# EAGLE design robot (EAGLE 5.12)
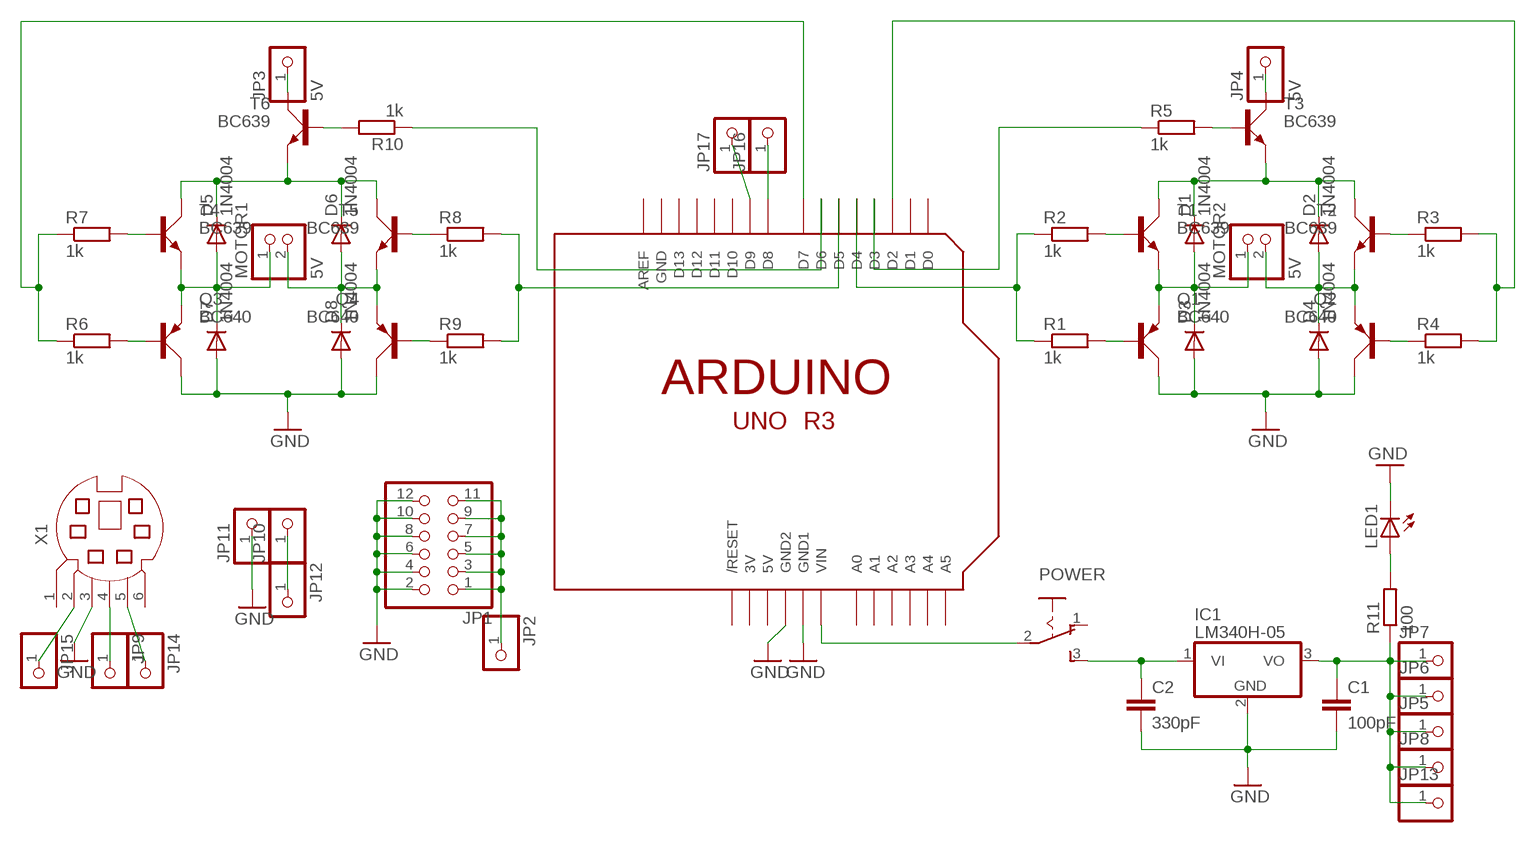
[diagram p0: schematic, sheet 1]

## Parts
C1  100pF  C-EU025-024X044  [C025-024X044]
C2  330pF  C-EU025-024X044  [C025-024X044]
D1  1N4004  [DO41-10]
D2  1N4004  [DO41-10]
D3  1N4004  [DO41-10]
D4  1N4004  [DO41-10]
D5  1N4004  [DO41-10]
D6  1N4004  [DO41-10]
D7  1N4004  [DO41-10]
D8  1N4004  [DO41-10]
IC1  LM340H-05  [TO220H]
JP1  PINHD-2X6  [2X06]
JP2  PINHD-1X1  [1X01]
JP3  5V  PINHD-1X1  [1X01]
JP4  5V  PINHD-1X1  [1X01]
JP5  PINHD-1X1  [1X01]
JP6  PINHD-1X1  [1X01]
JP7  PINHD-1X1  [1X01]
JP8  PINHD-1X1  [1X01]
JP9  PINHD-1X1  [1X01]
JP10  PINHD-1X1  [1X01]
JP11  PINHD-1X1  [1X01]
JP12  PINHD-1X1  [1X01]
JP13  PINHD-1X1  [1X01]
JP14  PINHD-1X1  [1X01]
JP15  PINHD-1X1  [1X01]
JP16  PINHD-1X1  [1X01]
JP17  PINHD-1X1  [1X01]
LED1  LED3MM  [LED3MM]
MOTOR1  5V  PINHD-1X2  [1X02]
MOTOR2  5V  PINHD-1X2  [1X02]
POWER  255SB  [255SB]
Q1  BC640  [SOT54D]
Q2  BC640  [SOT54D]
Q3  BC640  [SOT54D]
Q4  BC640  [SOT54D]
R1  1k  R-EU_0207/7  [0207/7]
R2  1k  R-EU_0207/7  [0207/7]
R3  1k  R-EU_0207/7  [0207/7]
R4  1k  R-EU_0207/7  [0207/7]
R5  1k  R-EU_0207/7  [0207/7]
R6  1k  R-EU_0207/7  [0207/7]
R7  1k  R-EU_0207/7  [0207/7]
R8  1k  R-EU_0207/7  [0207/7]
R9  1k  R-EU_0207/7  [0207/7]
R10  1k  R-EU_0207/7  [0207/7]
R11  100  R-EU_0207/7  [0207/7]
T1  BC639  [SOT54D]
T2  BC639  [SOT54D]
T3  BC639  [SOT54D]
T4  BC639  [SOT54D]
T5  BC639  [SOT54D]
T6  BC639  [SOT54D]
U$1  ARDUINO-NOHOLE  [ARDUINO-NOHOLE]
X1  MD06SS  [MDIN06SS]

## Nets
GND: C1.2 C2.2 D3.A D4.A D7.A D8.A IC1.2(GND) JP1.2 JP1.4 JP1.6 JP1.8 JP1.10 JP1.12 JP11.1 LED1.K(C) Q1.C Q2.C Q3.C Q4.C U$1.GND1 U$1.GND2 X1.3
N$1: D1.C D2.C T1.C T2.C T3.E
N$2: R7.2 T4.B
N$3: D1.A D3.C MOTOR2.1 Q1.E T1.E
N$4: R3.2 R4.2 U$1.D2
N$5: D2.A D4.C MOTOR2.2 Q2.E T2.E
N$6: R1.1 R2.1 U$1.D4
N$7: R5.1 U$1.D3
N$8: R10.1 U$1.D6
N$9: Q3.B R6.2
N$10: JP14.1 X1.5
N$12: JP3.1 T6.C
N$13: POWER.2(P) U$1.VIN
N$14: D6.A D8.C MOTOR1.2 Q4.E T5.E
N$15: R10.2 T6.B
N$16: R8.1 T5.B
N$17: JP9.1 X1.4
N$18: Q4.B R9.1
N$19: JP15.1 X1.2
N$20: D5.C D6.C T4.C T5.C T6.E
N$21: R6.1 R7.1 U$1.D7
N$22: C2.1 IC1.1(VI) POWER.3(S)
N$23: R8.2 R9.2 U$1.D5
N$24: D5.A D7.C MOTOR1.1 Q3.E T4.E
N$25: LED1.A R11.2
N$26: Q2.B R4.1
N$27: R3.1 T2.B
N$28: C1.1 IC1.3(VO) JP5.1 JP6.1 JP7.1 JP8.1 JP13.1 R11.1
N$29: JP10.1 JP12.1
N$30: JP16.1 U$1.D8
N$31: JP1.1 JP1.3 JP1.5 JP1.7 JP1.9 JP1.11 JP2.1
N$32: JP17.1 U$1.D9
N$33: Q1.B R1.2
N$34: R2.2 T1.B
N$35: R5.2 T3.B
N$36: JP4.1 T3.C
Unconnected: POWER.1(O) U$1.A0 U$1.A1 U$1.A2 U$1.A3 U$1.A4 U$1.A5 U$1.AREF U$1.D0 U$1.D1 U$1.D10 U$1.D11 U$1.D12 U$1.D13 U$1.RESET(/RESET) X1.1 X1.6

## Power pins joined to a net without a drawn wire
3V: U$1.3V
5V: U$1.5V
GND: U$1.GND

## Library data of the parts
C1 C2 = rcl:C-EU: CAPACITOR, European symbol
D1-D8 = diode:1N4004: DIODE general purpose rectifier, 1 A
IC1 = linear:LM340?-*: Positive VOLTAGE REGULATOR Source: http://cache.national.com/ds/LM/LM340.pdf
JP1 = pinhead:PINHD-2X6: PIN HEADER
JP2-JP17 = pinhead:PINHD-1X1: PIN HEADER
LED1 = led:LED: LED OSRAM: - CHIPLED LG R971, LG N971, LY N971, LG Q971, LY Q971, LO R971, LY R971 LH N974, LH R974 LS Q976, LO Q976, LY Q976 LO Q996 - Hyper CHIPLED LW Q18S LB Q993, LB Q99A, LB R99A - SideLED LS A670, LO A670, LY A670, LG A670, LP A670 LB A673, LV A673, LT A673, LW A673 LH A674 LY A675 LS A676, LA A676, LO A676, LY A676, LW A676 LS A679, LY A679, LG A679 - Hyper Micro SIDELED® LS Y876, LA Y876, LO Y876, LY Y876 LT Y87S - SmartLED LW L88C, LW L88S LB L89C, LB L89S, LG L890 LS L89K, LO L89K, LY L89K LS L896, LA L896, LO L896, LY L896 - TOPLED LS T670, LO T670, LY T670, LG T670, LP T670 LSG T670, LSP T670, LSY T670, LOP T670, LYG T670 LG T671, LOG T671, LSG T671 LB T673, LV T673, LT T673, LW T673 LH T674 LS T676, LA T676, LO T676, LY T676, LB T676, LH T676, LSB T676, LW T676 LB T67C, LV T67C, LT T67C, LS T67K, LO T67K, LY T67K, LW E67C LS E67B, LA E67B, LO E67B, LY E67B, LB E67C, LV E67C, LT E67C LW T67C LS T679, LY T679, LG T679 LS T770, LO T770, LY T770, LG T770, LP T770 LB T773, LV T773, LT T773, LW T773 LH T774 LS E675, LA E675, LY E675, LS T675 LS T776, LA T776, LO T776, LY T776, LB T776 LHGB T686 LT T68C, LB T68C - Hyper Mini TOPLED® LB M676 - Mini TOPLED Santana® LG M470 LS M47K, LO M47K, LY M47K Source: http://www.osram.convergy.de LUXEON: - LUMILED® LXK2-PW12-R00, LXK2-PW12-S00, LXK2-PW14-U00, LXK2-PW14-V00 LXK2-PM12-R00, LXK2-PM12-S00, LXK2-PM14-U00 LXK2-PE12-Q00, LXK2-PE12-R00, LXK2-PE12-S00, LXK2-PE14-T00, LXK2-PE14-U00 LXK2-PB12-K00, LXK2-PB12-L00, LXK2-PB12-M00, LXK2-PB14-N00, LXK2-PB14-P00, LXK2-PB14-Q00 LXK2-PR12-L00, LXK2-PR12-M00, LXK2-PR14-Q00, LXK2-PR14-R00 LXK2-PD12-Q00, LXK2-PD12-R00, LXK2-PD12-S00 LXK2-PH12-R00, LXK2-PH12-S00 LXK2-PL12-P00, LXK2-PL12-Q00, LXK2-PL12-R00 Source: www.luxeon.com KINGBRIGHT: KA-3528ASYC Source: www.kingbright.com
MOTOR1 MOTOR2 = pinhead:PINHD-1X2: PIN HEADER
POWER = edited-switch:255SB: SLIDING SWITCH Distributor Buerklin, 11G810
Q1-Q4 = transistor-small-signal:BC640: PNP TRANSISTOR
R1-R11 = rcl:R-EU_: RESISTOR, European symbol
T1-T6 = transistor-small-signal:BC639: NPN TRANSISTOR
U$1 = arduino_uno:ARDUINO: Arduino Diecimila/Duemilanove Make a shield with ease, this package has all the named pins as well as the two mounting drill holes and an outline of the USB and DC power connector. The outline is on the DIMENSION layer, so if your board house uses it they will cut the outline to match. http://www.ladyada.net/library/pcb/eaglelibrary.html
X1 = con-yamaichi:MD06SS: YAMAICHI CONNECTOR; OC_FARNELL: unknown; OC_NEWARK: unknown

## Board
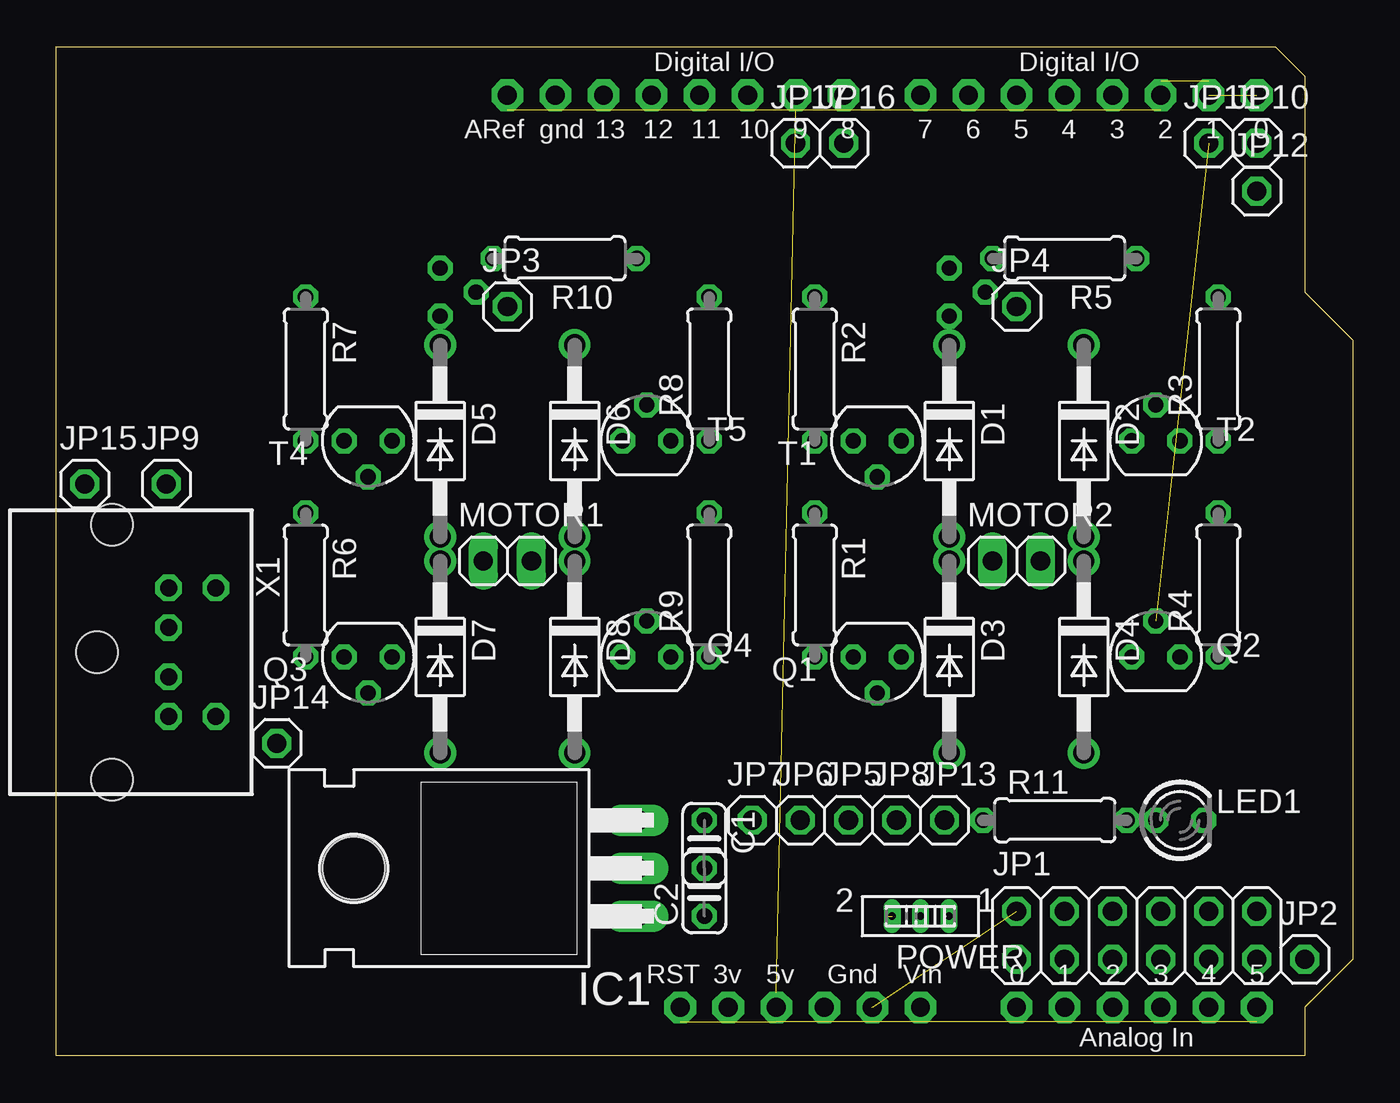
[diagram p1: board, top side]
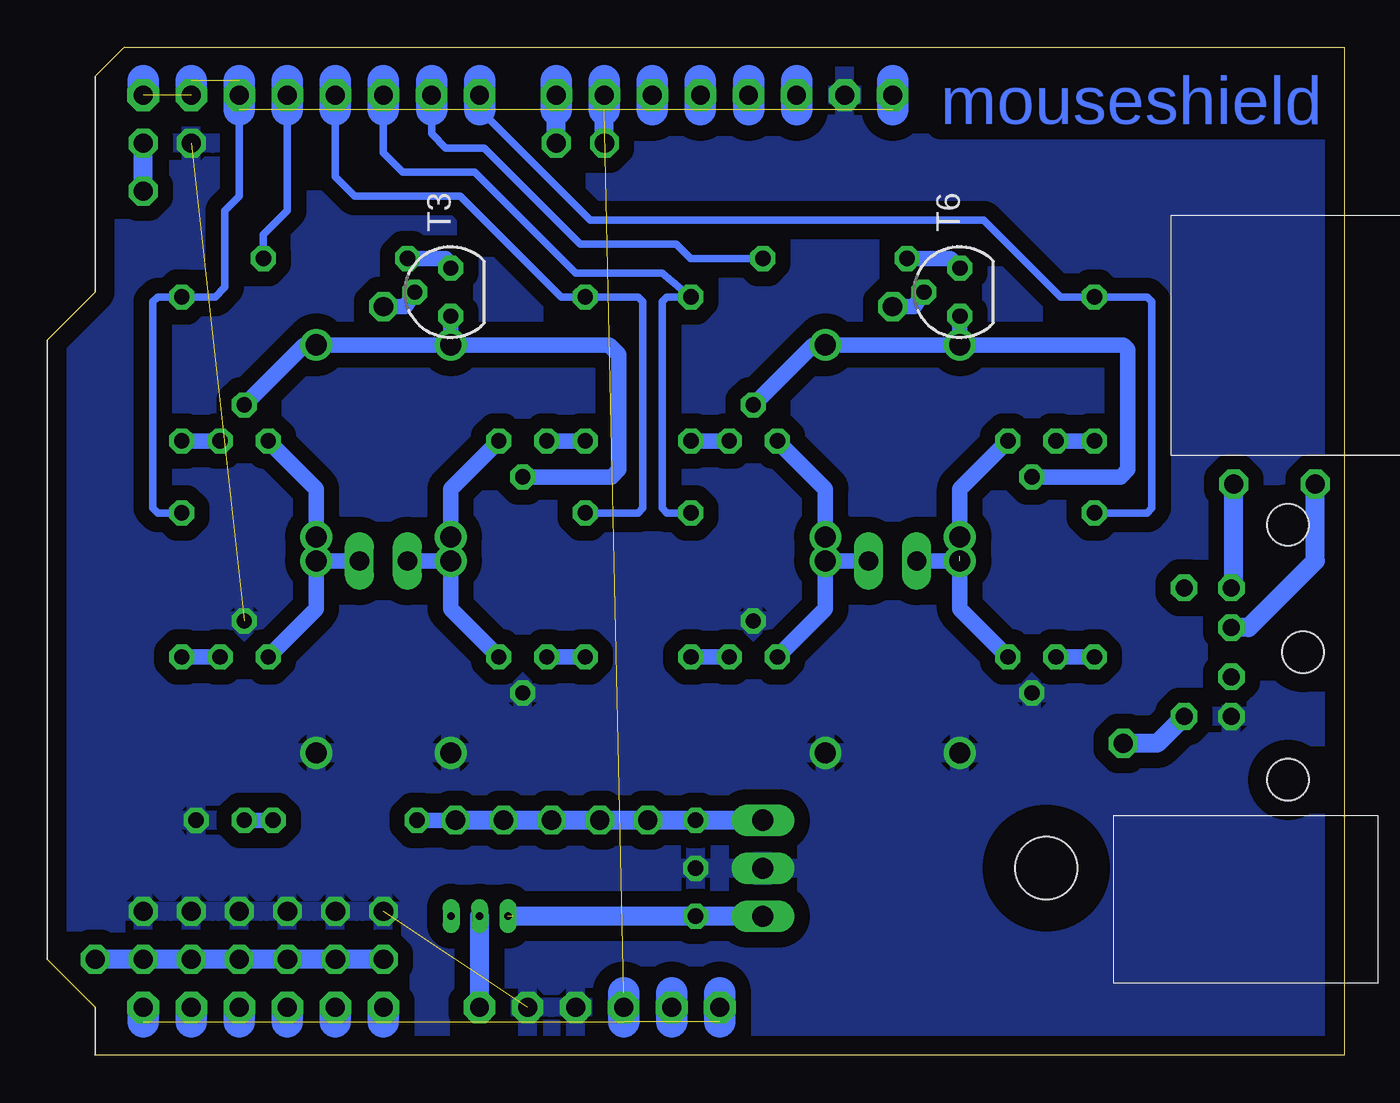
[diagram p2: board, bottom side, seen from below]

Size 68.58 x 53.34 mm. Coordinates in mm from the lower left corner, seen from the top.
Outline: 66.04,51.81 64.52,53.34 0,53.34 0,0 66.04,0 66.04,2.54 68.58,5.08 68.58,37.84
Outline: 66.04,51.82 66.04,40.39 68.58,37.84
Outline: 68.58,37.85 68.58,37.84
Copper layers (1*16): Top 0.035mm / dielectric 1.5mm / Bottom 0.035mm
Design rules "default": minimum track width 10mil, minimum drill 24mil, track to track 8mil, track to pad 8mil, pad to pad 8mil, via to via 8mil, smd to smd 8mil, copper to edge 40mil, drill to drill 8mil, minimum pad ring 10mil, minimum via ring 8mil, stop-mask expansion 4mil, vias tented up to drill 0mil, thermal gap 10mil

### Footprints (pad centres in the part's own frame; a part is rotated, then mirrored left to right if it is on the bottom)
C025-024X044 = drill 0.813 octagon: 1 -1.27,0; 2 1.27,0
DO41-10 = drill 1.118 round: A 5.08,0; C -5.08,0
TO220H = drill 1.118 long: 1 -2.54,-10.16; 2 0,-10.16; 3 2.54,-10.16 | hole 3.302: 0,4.826
2X06 = drill 1.016 octagon: 1 -6.35,-1.27; 2 -6.35,1.27; 3 -3.81,-1.27; 4 -3.81,1.27; 5 -1.27,-1.27; 6 -1.27,1.27; 7 1.27,-1.27; 8 1.27,1.27; 9 3.81,-1.27; 10 3.81,1.27; 11 6.35,-1.27; 12 6.35,1.27
1X01 = drill 1.016 octagon: 1 0,0
LED3MM = drill 0.813 octagon: A -1.27,0; K 1.27,0
1X02 = drill 1.016 long: 1 -1.27,0; 2 1.27,0
255SB = drill 0.4 long: 1 -1.5,0; 2 0,0; 3 1.5,0
SOT54D = drill 0.813 octagon: B 1.27,0; C 0,1.905; E -1.27,0
0207/7 = drill 0.813 octagon: 1 -3.81,0; 2 3.81,0
ARDUINO-NOHOLE = drill 1 pad 1.676 octagon: 3V 35.56,2.54; 5V 38.1,2.54; A0 50.8,2.54; A1 53.34,2.54; A2 55.88,2.54; A3 58.42,2.54; A4 60.96,2.54; A5 63.5,2.54; AREF 23.876,50.8; D0 63.5,50.8; D1 60.96,50.8; D2 58.42,50.8; D3 55.88,50.8; D4 53.34,50.8; D5 50.8,50.8; D6 48.26,50.8; D7 45.72,50.8; D8 41.656,50.8; D9 39.116,50.8; D10 36.576,50.8; D11 34.036,50.8; D12 31.496,50.8; D13 28.956,50.8; GND 26.416,50.8; GND1 43.18,2.54; GND2 40.64,2.54; RESET 33.02,2.54; VIN 45.72,2.54
MDIN06SS = drill 0.9 octagon: 1 1.3,8.5; 2 -1.3,8.5; 3 3.4,8.5; 4 -3.4,8.5; 5 3.4,11; 6 -3.4,11 | hole 2.2: -6.75,5.5; 0,4.7; 6.75,5.5

### Placement (x,y rotation side)
C1  34.29,11.18 270 top
C2  34.29,8.64 90 top
D1  47.24,32.51 270 top
D2  54.36,32.51 270 top
D3  47.24,21.08 270 top
D4  54.36,21.08 270 top
D5  20.32,32.51 270 top
D6  27.43,32.51 270 top
D7  20.32,21.08 270 top
D8  27.43,21.08 270 top
IC1  20.57,9.91 90 top
JP1  57.15,6.35 0 top
JP2  66.04,5.08 0 top
JP3  23.88,39.62 0 top
JP4  50.8,39.62 0 top
JP5  41.91,12.45 0 top
JP6  39.37,12.45 0 top
JP7  36.83,12.45 0 top
JP8  44.45,12.45 0 top
JP9  5.84,30.23 0 top
JP10  63.5,48.26 0 top
JP11  60.96,48.26 0 top
JP12  63.5,45.72 0 top
JP13  46.99,12.45 0 top
JP14  11.68,16.51 0 top
JP15  1.52,30.23 0 top
JP16  41.66,48.26 0 top
JP17  39.12,48.26 0 top
LED1  59.44,12.45 0 top
MOTOR1  23.88,26.16 0 top
MOTOR2  50.8,26.16 0 top
POWER  45.72,7.37 180 top
Q1  43.43,21.08 180 top
Q2  58.17,21.08 0 top
Q3  16.51,21.08 180 top
Q4  31.24,21.08 0 top
R1  40.13,24.89 270 top
R2  40.13,36.32 270 top
R3  61.47,36.32 90 top
R4  61.47,24.89 90 top
R5  53.34,42.16 180 top
R6  13.21,24.89 270 top
R7  13.21,36.32 270 top
R8  34.54,36.32 90 top
R9  34.54,24.89 90 top
R10  26.92,42.16 180 top
R11  52.83,12.45 0 top
T1  43.43,32.51 180 top
T2  58.17,32.51 0 top
T3  47.24,40.39 90 bottom
T4  16.51,32.51 180 top
T5  31.24,32.51 0 top
T6  20.32,40.39 90 bottom
U$1  0,0 0 top
X1  -2.54,21.34 270 top

### Tracks (layer width: path | path; a pad name or v marks a point on that pad's centre or on a via)
GND  (2 unrouted)
  pour Bottom (isolate 0.813): 0,53.34 64.52,53.34 66.04,51.82 66.04,40.39 68.58,37.85 68.58,5.08 66.04,2.54 66.04,0 0,0
N$1
  Bottom 0.813: D1.C D2.C 54.99,37.59 T2.C | D1.C T3.E | T1.C 38.73,30.61 38.35,30.99 38.35,37.08 38.86,37.59 D1.C
N$2
  Bottom 0.813: R7.2 T4.B
N$3
  Bottom 0.813: D3.C MOTOR2.1 | D3.C D1.A 47.24,29.97 T1.E | D3.C 47.24,23.62 Q1.E
N$4
  Bottom 0.406: R4.2 62.74,28.7 62.99,28.96 62.99,39.88 62.74,40.13 R3.2 59.69,40.13 59.18,40.64 59.18,44.7 58.42,45.47 U$1.D2
N$5
  Bottom 0.813: D4.C MOTOR2.2 | D4.C D2.A 54.36,29.97 T2.E | D4.C 54.36,23.62 Q2.E
N$6
  Bottom 0.406: R1.1 37.34,28.7 37.08,28.96 37.08,39.88 37.34,40.13 R2.1 41.4,40.13 46.74,45.47 52.32,45.47 53.34,46.48 U$1.D4
N$7
  Bottom 0.406: R5.1 57.15,43.43 55.88,44.7 U$1.D3
N$8
  Bottom 0.406: R10.1 34.54,42.16 35.31,42.93 40.39,42.93 45.47,48.01 47.5,48.01 48.26,48.77 U$1.D6
N$9
  Bottom 0.813: R6.2 Q3.B
N$10
  Bottom 1.016: JP14.1 9.89,16.51 X1.5
N$12
  Bottom 0.813: JP3.1 22.73,39.62 T6.C
N$13
  Bottom 1.016: U$1.VIN POWER.2
N$14
  Bottom 0.813: D8.C MOTOR1.2 | D8.C D6.A 27.43,29.97 T5.E | D8.C 27.43,23.62 Q4.E
N$15
  Bottom 0.813: T6.B 20.83,42.16 R10.2
N$16
  Bottom 0.813: T5.B R8.1
N$17
  Bottom 1.016: JP9.1 5.84,24.85 X1.4
N$18
  Bottom 0.813: Q4.B R9.1
N$19
  Bottom 1.016: X1.2 5.05,22.64 1.52,26.16 JP15.1
N$20
  Bottom 0.813: D5.C D6.C 28.07,37.59 T5.C | D5.C T6.E | T4.C 11.81,30.61 11.43,30.99 11.43,37.34 11.68,37.59 D5.C
N$21
  Bottom 0.406: R6.1 10.41,28.7 10.16,28.96 10.16,39.88 10.41,40.13 R7.1 14.99,40.13 19.05,44.2 39.88,44.2 45.72,50.04 U$1.D7
N$22  (1 unrouted)
  Bottom 1.016: IC1.1 C2.1 43.94,7.37
N$23
  Bottom 0.406: R9.2 35.81,28.7 36.07,28.96 36.07,39.88 35.81,40.13 R8.2 36.07,41.4 40.64,41.4 45.97,46.74 49.78,46.74 50.8,47.75 U$1.D5
N$24  (1 unrouted)
  Bottom 0.813: MOTOR1.1 D7.C 20.32,23.62 Q3.E | 20.32,26.42 D5.A 20.32,29.97 T4.E
N$25
  Bottom 0.813: LED1.A R11.2
N$26
  Bottom 0.813: Q2.B R4.1
N$27
  Bottom 0.813: T2.B R3.1
N$28
  Bottom 0.813: JP13.1 R11.1
  Bottom 1.016: C1.1 IC1.3 JP7.1 JP6.1 JP5.1 JP8.1 JP13.1
N$29
  Bottom 1.016: JP12.1 JP10.1
N$30
  Bottom 1.016: JP16.1 U$1.D8
N$31
  Bottom 1.016: JP1.1 JP1.3 JP1.5 JP1.7 JP1.9 JP1.11 JP2.1
N$32
  Bottom 1.016: JP17.1 U$1.D9
N$33
  Bottom 0.813: R1.2 Q1.B
N$34
  Bottom 0.813: R2.2 T1.B
N$35
  Bottom 0.813: T3.B 47.5,42.16 R5.2
N$36
  Bottom 0.813: JP4.1 49.66,39.62 T3.C
N$37  (23 unrouted)
  Bottom 1.676: 23.88,50.04 23.88,51.56 | 28.96,50.04 28.96,51.56 | 31.5,50.04 31.5,51.56 | 34.04,50.04 34.04,51.56 | 36.58,50.04 36.58,51.56 | 39.12,50.04 39.12,51.56 | 41.66,50.04 41.66,51.56 | 45.72,50.04 45.72,51.56 | 48.26,50.04 48.26,51.56 | 50.8,50.04 50.8,51.56 | 53.34,50.04 53.34,51.56 | 55.88,50.04 55.88,51.56 | 58.42,50.04 58.42,51.56 | 38.1,1.78 38.1,3.3 | 35.56,1.78 35.56,3.3 | 33.02,1.78 33.02,3.3 | 50.8,1.78 50.8,2.54 | 53.34,1.78 53.34,2.54 | 55.88,1.78 55.88,2.54 | 58.42,1.78 58.42,2.54 | 60.96,1.78 60.96,2.54 | 63.5,1.78 63.5,2.54 | 60.96,50.8 60.96,51.56 | 63.5,50.8 63.5,51.56

### Text on the board
Bottom: mouseshield